# EAGLE design ARDUNI UNO - HEATER KOPI (EAGLE 9.6.1)
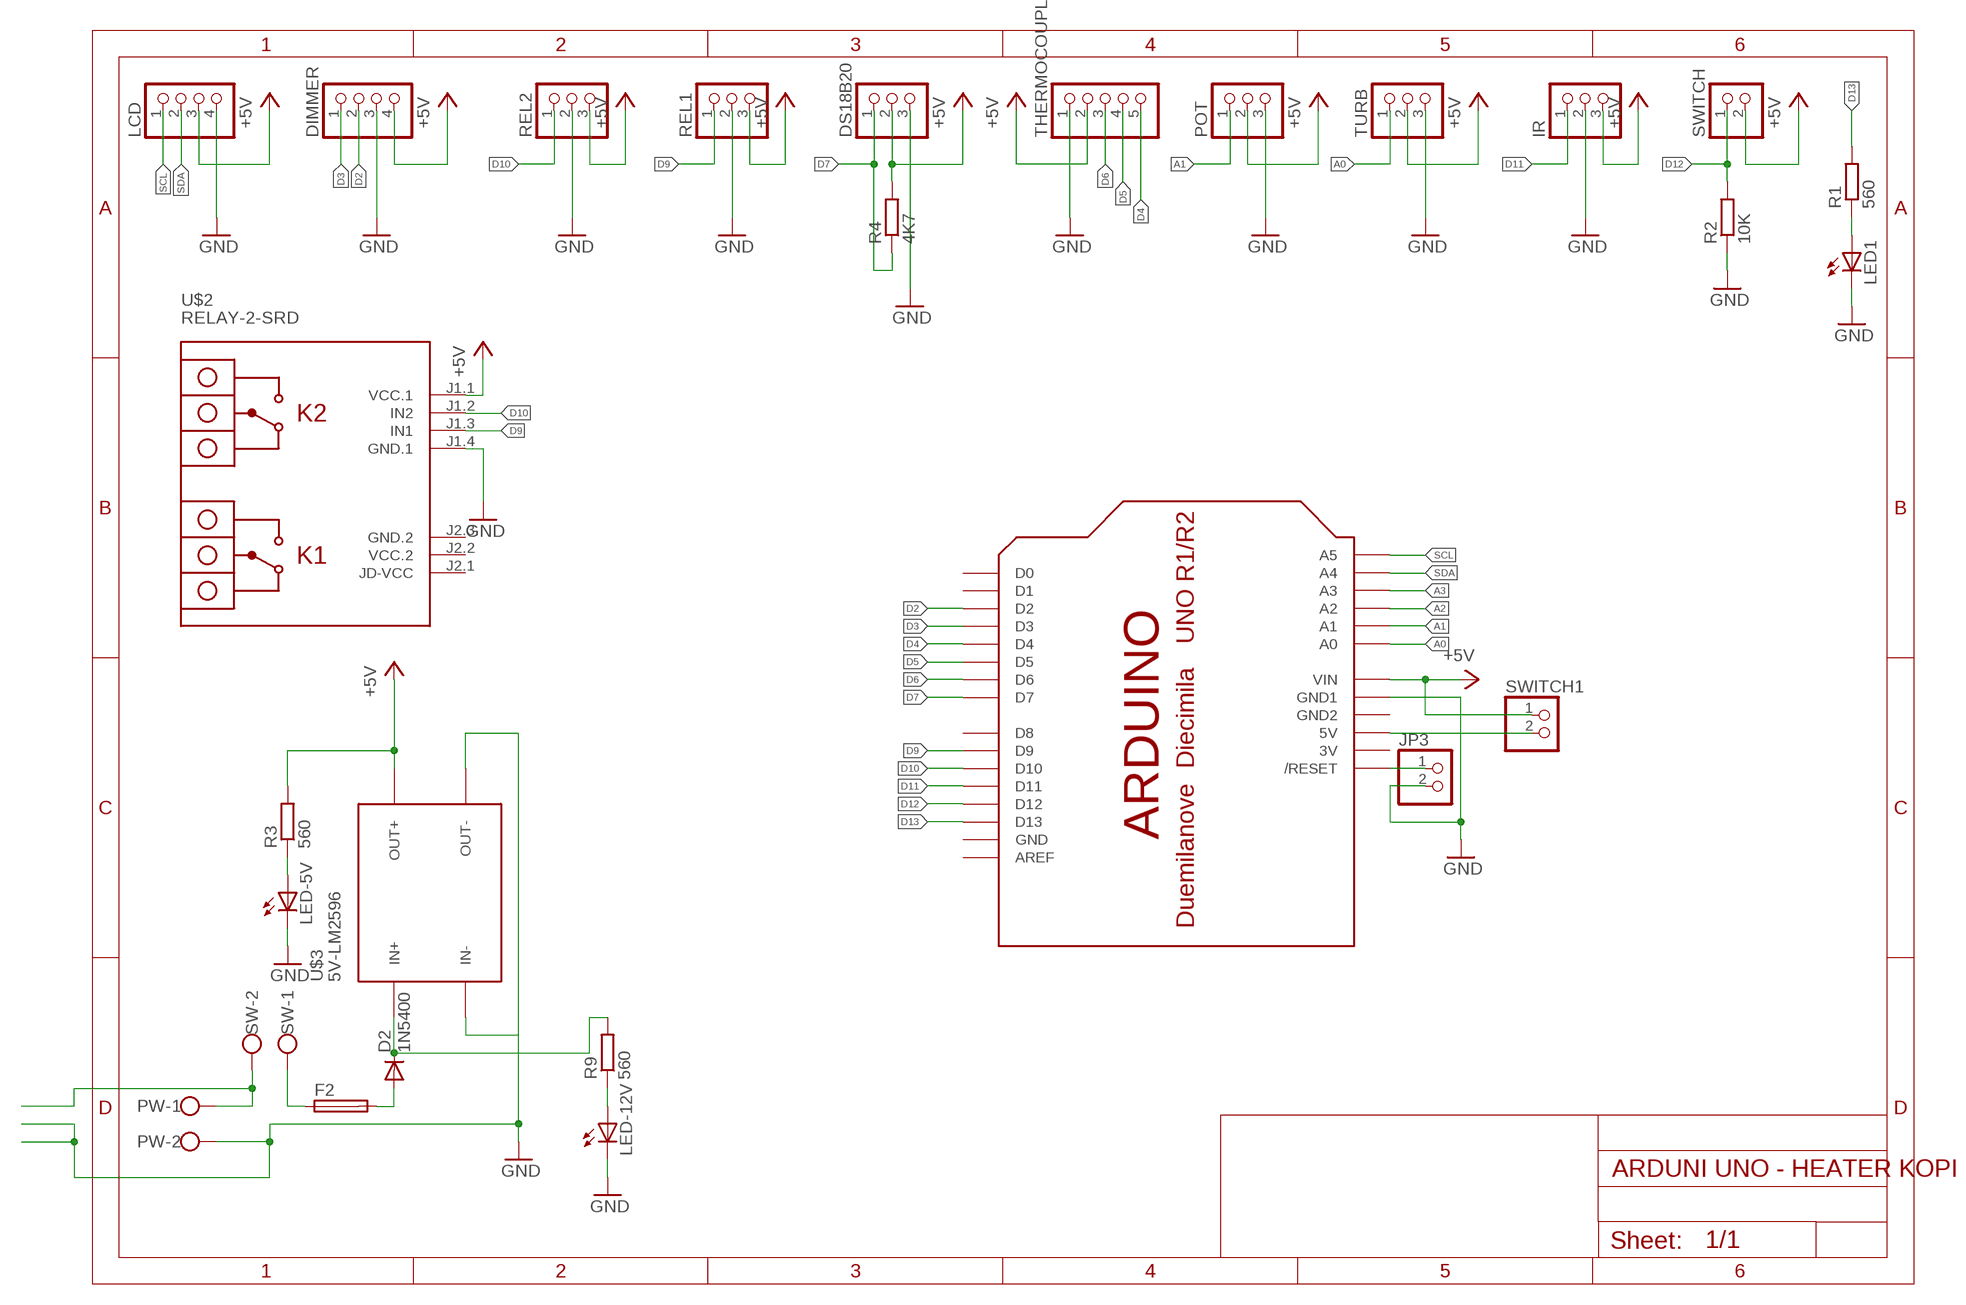
[diagram p0: schematic, sheet 1]

## Parts
D2  1N5400  [DO201-15]
DIMMER  PINHD-1X4  [1X04]
DS18B20  PINHD-1X3  [1X03]
F2  SH22,5  [SH22,5]
IR  PINHD-1X3  [1X03]
JP3  PINHD-1X2  [1X02]
LCD  PINHD-1X4  [1X04]
LED1  LED3MM  [LED3MM]
LED-5V  LED3MM  [LED3MM]
LED-12V  LED3MM  [LED3MM]
POT  PINHD-1X3  [1X03]
PW  W237-102  [W237-102]
R1  560  R-EU_0204/7  [0204/7]
R2  10K  R-EU_0204/7  [0204/7]
R3  560  R-EU_0204/7  [0204/7]
R4  4K7  R-EU_0204/7  [0204/7]
R9  560  R-EU_0204/7  [0204/7]
REL1  PINHD-1X3  [1X03]
REL2  PINHD-1X3  [1X03]
SW  W237-102  [W237-102]
SWITCH  PINHD-1X2  [1X02]
SWITCH1  PINHD-1X2  [1X02]
THERMOCOUPLE  PINHD-1X5  [1X05]
TURB  PINHD-1X3  [1X03]
U$1  ARDUINOUNO  [ARDUINO]
U$2  RELAY-2-SRD  [RELAY-2-SRD]
U$3  5V-LM2596  DC-DC-STEP-DOWN-LM2596  [DC-DC-STEP-DOWN-LM2596]

## Nets
+5V: DIMMER.4 DS18B20.2 IR.3 LCD.3 POT.2 R3.2 R4.2 REL1.3 REL2.3 SWITCH1.1 SWITCH.2 THERMOCOUPLE.2 TURB.2 U$1.VIN U$2.J1.1(VCC.1) U$3.OUT+
+12V: D2.C R9.2 U$3.IN+
A0: TURB.1 U$1.A0
A1: POT.1 U$1.A1
A2: U$1.A2
A3: U$1.A3
D2: DIMMER.2 U$1.D2
D3: DIMMER.1 U$1.D3
D4: THERMOCOUPLE.5 U$1.D4
D5: THERMOCOUPLE.4 U$1.D5
D6: THERMOCOUPLE.3 U$1.D6
D7: DS18B20.1 R4.1 U$1.D7
D9: REL1.1 U$1.D9 U$2.J1.3(IN1)
D10: REL2.1 U$1.D10 U$2.J1.2(IN2)
D11: IR.1 U$1.D11
D12: R2.2 SWITCH.1 U$1.D12
D13: R1.2 U$1.D13
GND: DIMMER.3 DS18B20.3 IR.2 JP3.2 LCD.4 LED1.K(C) LED-5V.K(C) LED-12V.K(C) POT.3 PW.2 R2.1 REL1.2 REL2.2 THERMOCOUPLE.1 TURB.3 U$1.GND1 U$2.J1.4(GND.1) U$3.IN- U$3.OUT-
N$1: F2.1 SW.1
N$2: JP3.1 U$1.RESET(/RESET)
N$3: SWITCH1.2 U$1.5V
N$4: LED1.A R1.1
N$8: LED-12V.A R9.1
N$11: D2.A F2.2
N$35: LED-5V.A R3.1
N$39: PW.1 SW.2
SCL: LCD.1 U$1.A5
SDA: LCD.2 U$1.A4
Unconnected: U$1.AREF U$1.D0 U$1.D1 U$1.D8 U$2.J2.1(JD-VCC)

## Power pins joined to a net without a drawn wire
3V: U$1.3V
GND: U$1.GND
GND2: U$1.GND2
GND.2: U$2.J2.3(GND.2)
VCC.2: U$2.J2.2(VCC.2)

## Library data of the parts
D2 = diode:1N5400: DIODE standard rectifier, 3 A, 50 V (Motorola)
DIMMER LCD = pinhead:PINHD-1X4: PIN HEADER
DS18B20 IR POT REL1 REL2 TURB = pinhead:PINHD-1X3: PIN HEADER
F2 = fuse:SH22,5: FUSE HOLDER grid 22,5 mm, OGN0031 8201, Schurter (Buerklin); MF: SCHURTER; MPN: 0031.8201; OC_FARNELL: 1162740; OC_NEWARK: 96F8317
JP3 SWITCH SWITCH1 = pinhead:PINHD-1X2: PIN HEADER
LED1 LED-5V LED-12V = led:LED: LED OSRAM: - CHIPLED LG R971, LG N971, LY N971, LG Q971, LY Q971, LO R971, LY R971 LH N974, LH R974 LS Q976, LO Q976, LY Q976 LO Q996 - Hyper CHIPLED LW Q18S LB Q993, LB Q99A, LB R99A - SideLED LS A670, LO A670, LY A670, LG A670, LP A670 LB A673, LV A673, LT A673, LW A673 LH A674 LY A675 LS A676, LA A676, LO A676, LY A676, LW A676 LS A679, LY A679, LG A679 - Hyper Micro SIDELED® LS Y876, LA Y876, LO Y876, LY Y876 LT Y87S - SmartLED LW L88C, LW L88S LB L89C, LB L89S, LG L890 LS L89K, LO L89K, LY L89K LS L896, LA L896, LO L896, LY L896 - TOPLED LS T670, LO T670, LY T670, LG T670, LP T670 LSG T670, LSP T670, LSY T670, LOP T670, LYG T670 LG T671, LOG T671, LSG T671 LB T673, LV T673, LT T673, LW T673 LH T674 LS T676, LA T676, LO T676, LY T676, LB T676, LH T676, LSB T676, LW T676 LB T67C, LV T67C, LT T67C, LS T67K, LO T67K, LY T67K, LW E67C LS E67B, LA E67B, LO E67B, LY E67B, LB E67C, LV E67C, LT E67C LW T67C LS T679, LY T679, LG T679 LS T770, LO T770, LY T770, LG T770, LP T770 LB T773, LV T773, LT T773, LW T773 LH T774 LS E675, LA E675, LY E675, LS T675 LS T776, LA T776, LO T776, LY T776, LB T776 LHGB T686 LT T68C, LB T68C - Hyper Mini TOPLED® LB M676 - Mini TOPLED Santana® LG M470 LS M47K, LO M47K, LY M47K Source: http://www.osram.convergy.de LUXEON: - LUMILED® LXK2-PW12-R00, LXK2-PW12-S00, LXK2-PW14-U00, LXK2-PW14-V00 LXK2-PM12-R00, LXK2-PM12-S00, LXK2-PM14-U00 LXK2-PE12-Q00, LXK2-PE12-R00, LXK2-PE12-S00, LXK2-PE14-T00, LXK2-PE14-U00 LXK2-PB12-K00, LXK2-PB12-L00, LXK2-PB12-M00, LXK2-PB14-N00, LXK2-PB14-P00, LXK2-PB14-Q00 LXK2-PR12-L00, LXK2-PR12-M00, LXK2-PR14-Q00, LXK2-PR14-R00 LXK2-PD12-Q00, LXK2-PD12-R00, LXK2-PD12-S00 LXK2-PH12-R00, LXK2-PH12-S00 LXK2-PL12-P00, LXK2-PL12-Q00, LXK2-PL12-R00 Source: www.luxeon.com KINGBRIGHT: KA-3528ASYC Source: www.kingbright.com
PW SW = con-wago-500:W237-102: WAGO SCREW CLAMP; MPN: 237-102; OC_FARNELL: unknown; OC_NEWARK: 70K9898
R1-R4 R9 = rcl:R-EU_: RESISTOR, European symbol; SPICEPREFIX: R
THERMOCOUPLE = pinhead:PINHD-1X5: PIN HEADER
U$1 = adafruit:ARDUINO: Arduino Diecimila/Duemilanove Make a shield with ease, this package has all the named pins as well as the two mounting drill holes and an outline of the USB and DC power connector. The outline is on the DIMENSION layer, so if your board house uses it they will cut the outline to match. http://www.ladyada.net/library/pcb/eaglelibrary.html
U$2 = diy-modules:RELAY-2-SRD: 2-Channel Relay Module based on SRD-05VDC-SL-C relays Click here to find device on ebay.com <http://www.ebay.com/sch/two+channel+relay+module+optocoupler+5v>
U$3 = diy-modules:DC-DC-STEP-DOWN-LM2596: DC/DC Step-Down Regulator based on LM2596-ADJ chip LM2596 datasheet available here: http://www.ti.com/lit/ds/symlink/lm2596.pdf Click here to find device on ebay.com <http://www.ebay.com/sch/lm2596+power+regulator>

## Board
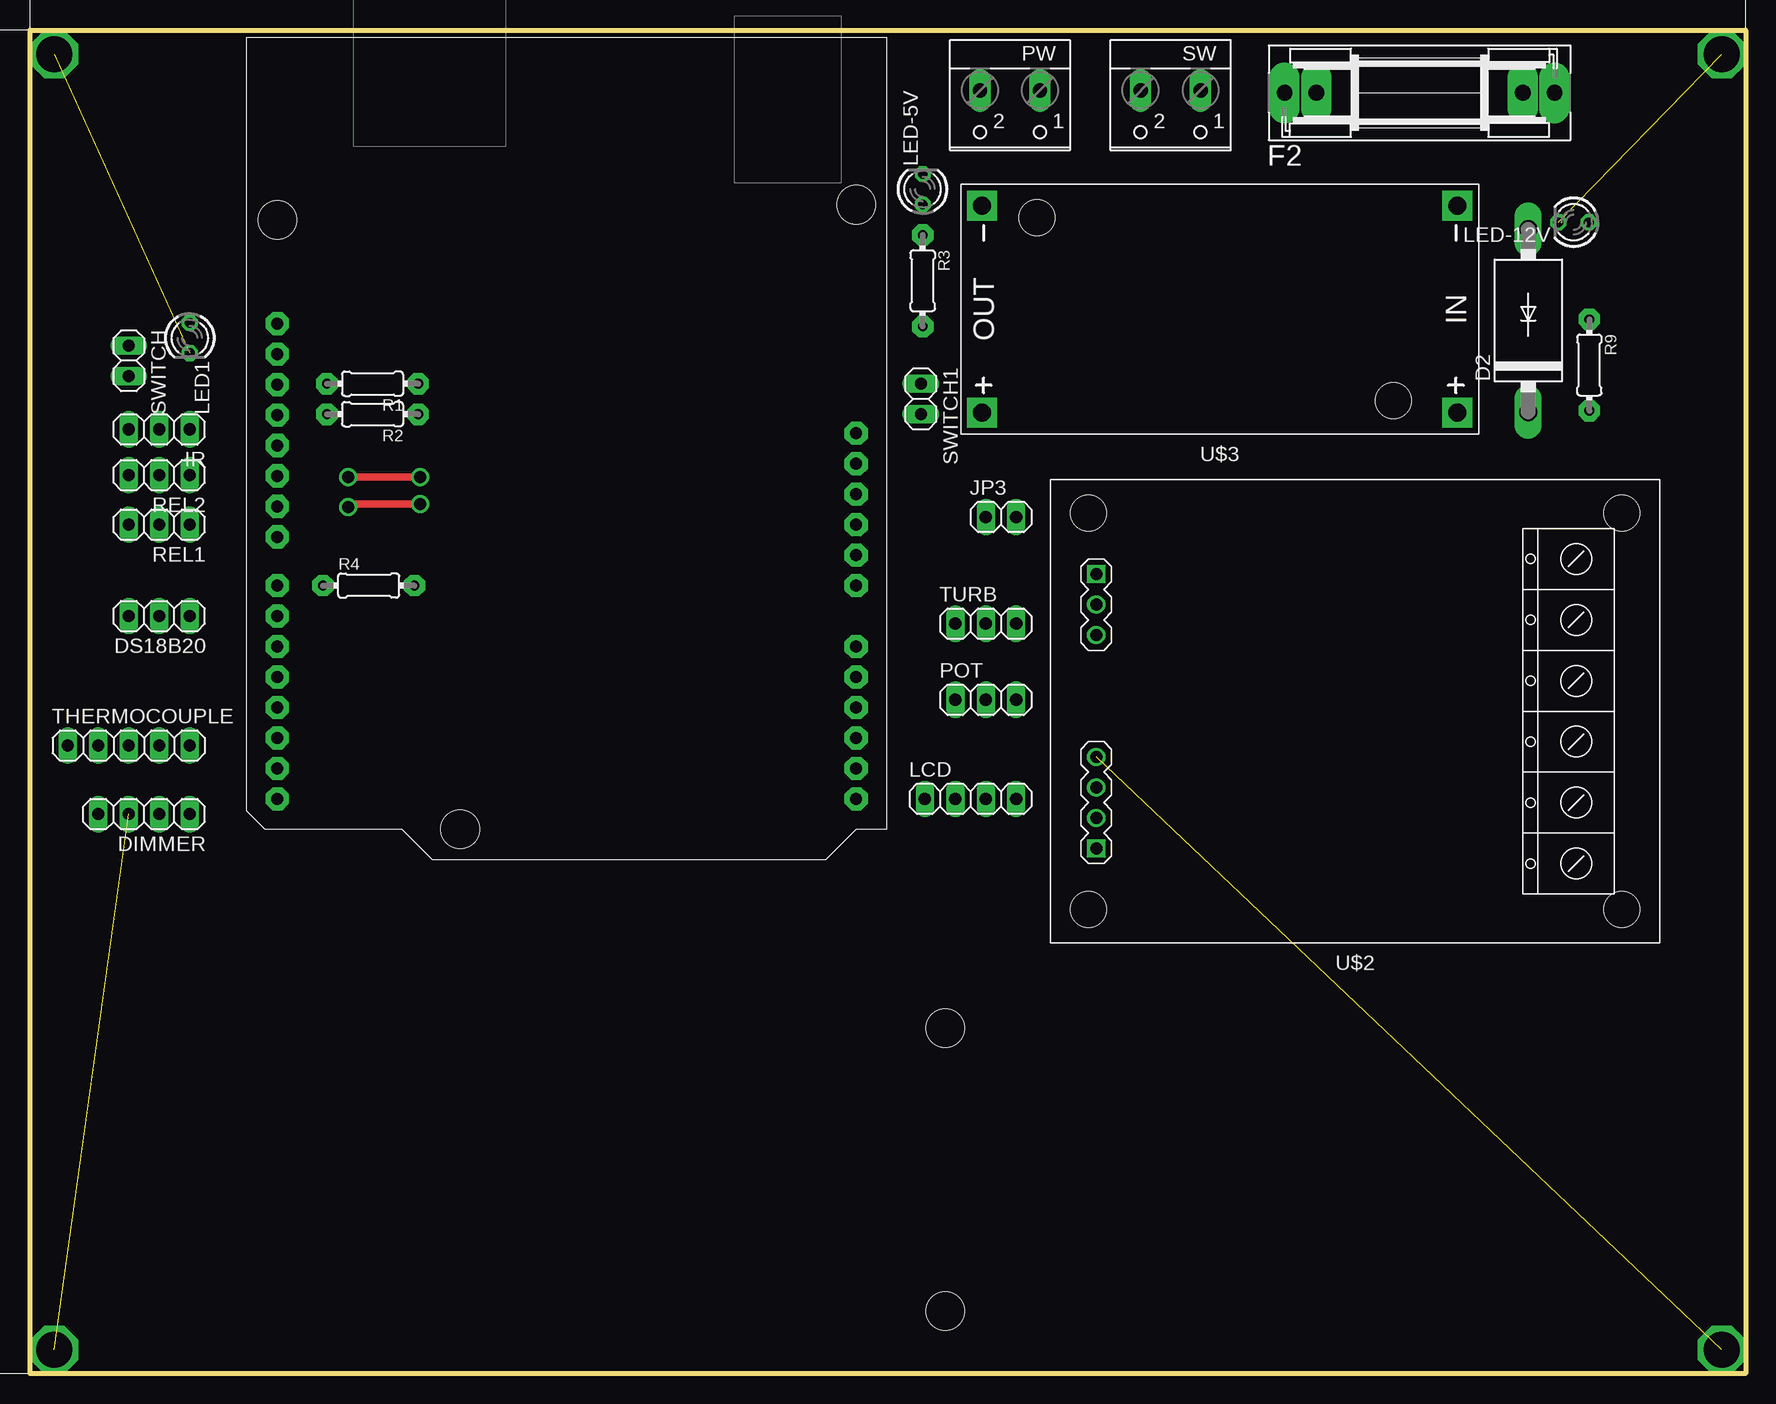
[diagram p1: board, top side]
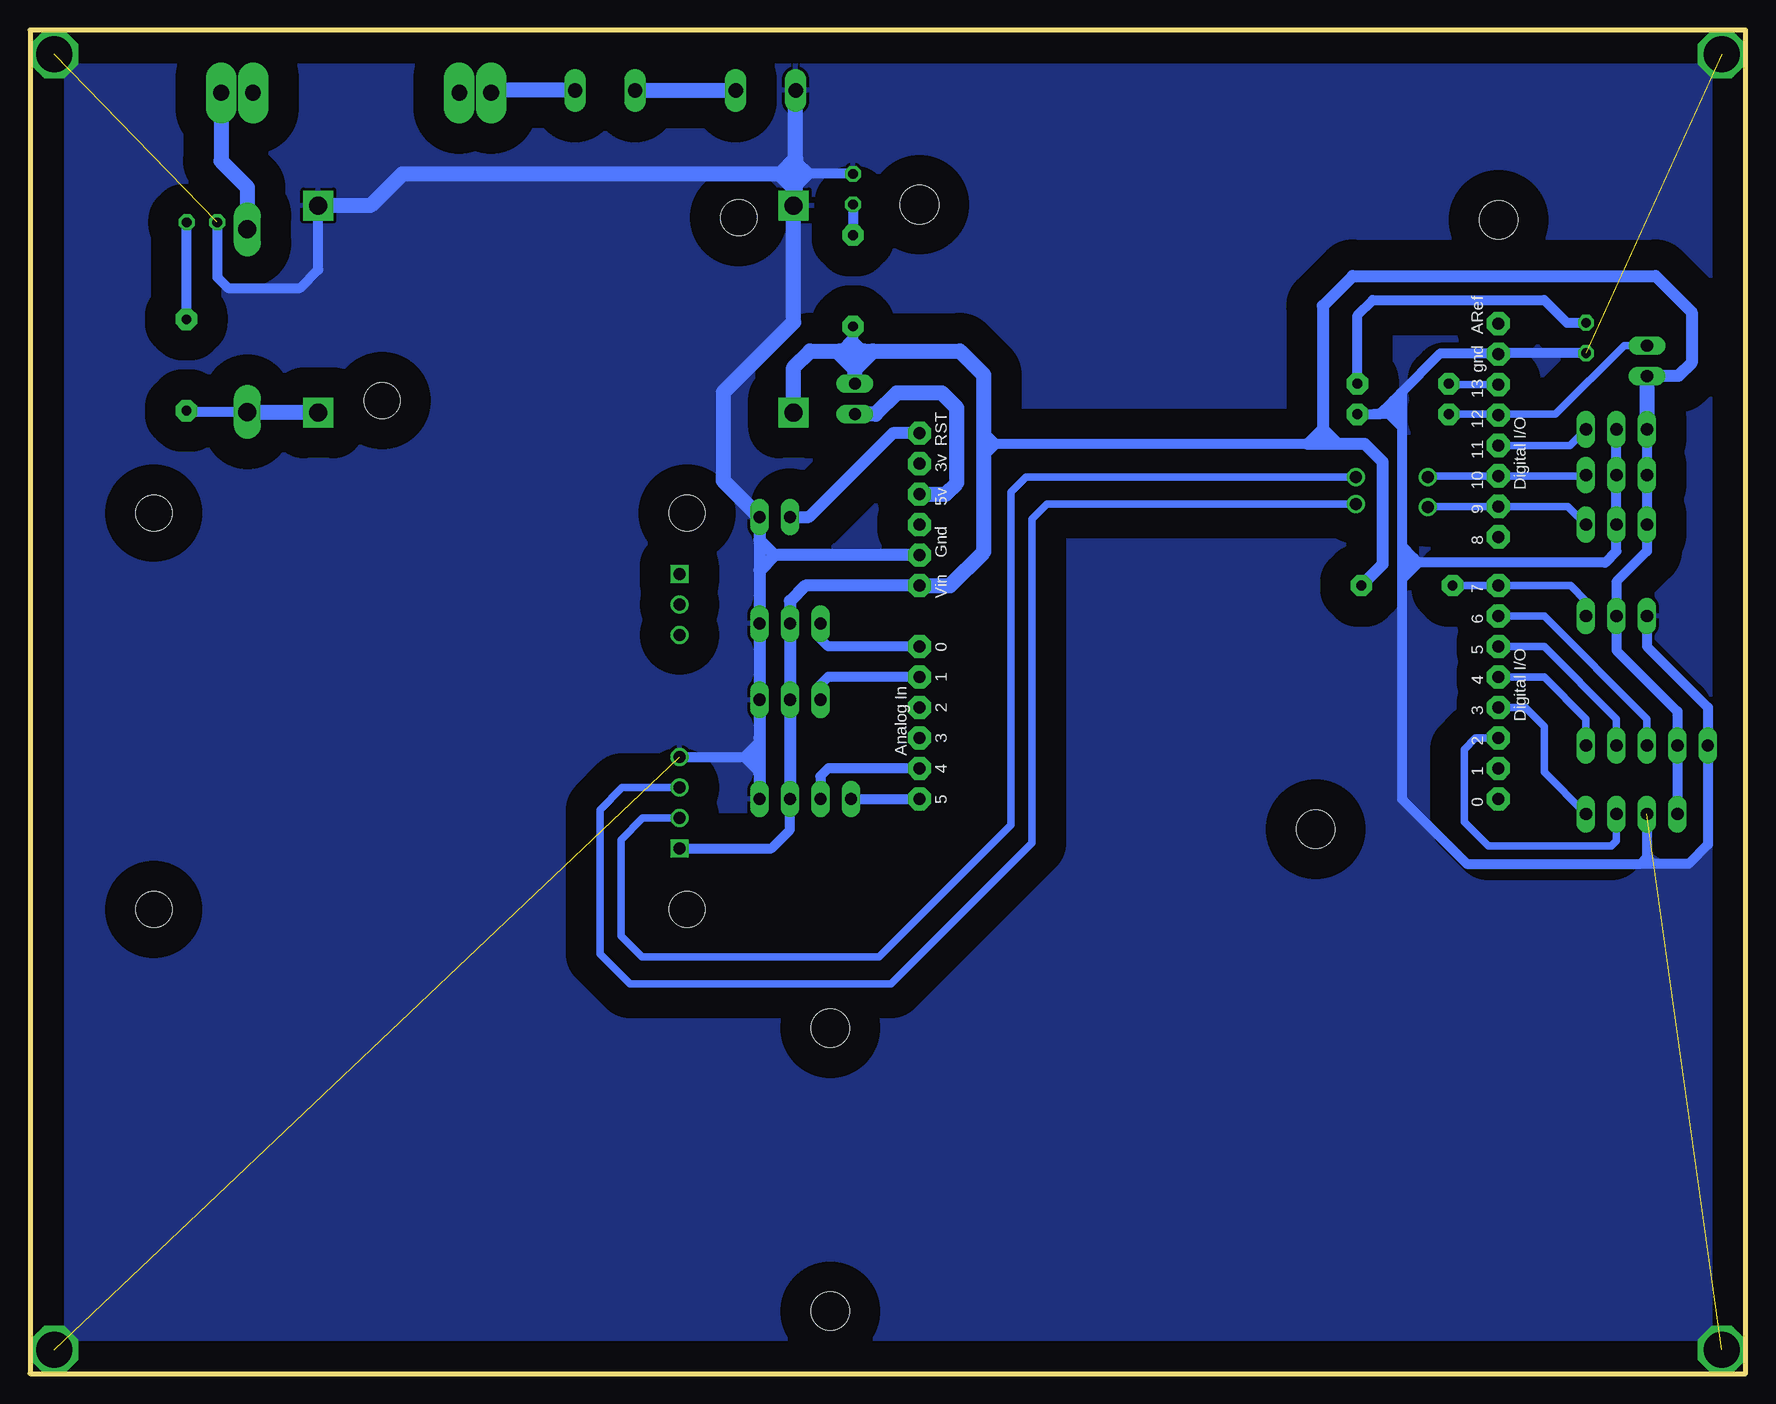
[diagram p2: board, bottom side, seen from below]

Size 143 x 112 mm. Coordinates in mm from the lower left corner, seen from the top.
Outline: 0,112 143,112 143,0 0,0 0,112
Copper layers (1*16): Top 0.035mm / dielectric 1.5mm / Bottom 0.035mm
Design rules "default": minimum track width 6mil, minimum drill 0.35mm, track to track 6mil, track to pad 6mil, pad to pad 6mil, via to via 6mil, smd to smd 6mil, copper to edge 40mil, drill to drill 6mil, minimum pad ring 10mil, minimum via ring 8mil, stop-mask expansion 4mil, vias tented up to drill 0mil, thermal gap 10mil
Holes 3.2 mm at 76.3,28.8 76.3,5.2

### Footprints (pad centres in the part's own frame; a part is rotated, then mirrored left to right if it is on the bottom)
DO201-15 = drill 1.499 long: A 7.62,0; C -7.62,0
1X04 = drill 1.016 long: 1 -3.81,0; 2 -1.27,0; 3 1.27,0; 4 3.81,0
1X03 = drill 1.016 long: 1 -2.54,0; 2 0,0; 3 2.54,0
SH22,5 = drill 1.321 pad 2.54 long: 1 -11.252,0; 2 11.252,0; P$1 -8.6,0; P$2 8.6,0
1X02 = drill 1.016 long: 1 -1.27,0; 2 1.27,0
LED3MM = drill 0.813 octagon: A -1.27,0; K 1.27,0
W237-102 = drill 1.194 long: 1 -2.5,-1.27; 2 2.5,-1.27
0204/7 = drill 0.813 pad 1.778 octagon: 1 -3.81,0; 2 3.81,0
1X05 = drill 1.016 long: 1 -5.08,0; 2 -2.54,0; 3 0,0; 4 2.54,0; 5 5.08,0
ARDUINO = drill 1 pad 1.93 octagon: 3V 35.56,2.54; 5V 38.1,2.54; A0 50.8,2.54; A1 53.34,2.54; A2 55.88,2.54; A3 58.42,2.54; A4 60.96,2.54; A5 63.5,2.54; AREF 23.876,50.8; D0 63.5,50.8; D1 60.96,50.8; D2 58.42,50.8; D3 55.88,50.8; D4 53.34,50.8; D5 50.8,50.8; D6 48.26,50.8; D7 45.72,50.8; D8 41.656,50.8; D9 39.116,50.8; D10 36.576,50.8; D11 34.036,50.8; D12 31.496,50.8; D13 28.956,50.8; GND 26.416,50.8; GND1 43.18,2.54; GND2 40.64,2.54; RESET 33.02,2.54; VIN 45.72,2.54 | hole 3.2: 15.24,50.8; 66.04,35.56; 13.97,2.54
RELAY-2-SRD = drill 1 square: J1.1 21.59,11.43; J2.1 21.59,-11.43 | drill 1: J1.2 21.59,8.89; J1.3 21.59,6.35; J1.4 21.59,3.81; J2.2 21.59,-8.89; J2.3 21.59,-6.35 | hole 3: -22.225,16.51; 22.225,16.51; 22.225,-16.51; -22.225,-16.51
DC-DC-STEP-DOWN-LM2596 = drill 1.5 pad 2.5 square: IN+ -19.812,8.636; IN- -19.812,-8.636; OUT+ 19.812,8.636; OUT- 19.812,-8.636 | hole 3: -14.478,7.62; 15.24,-7.62

### Placement (x,y rotation side)
D2  124.89,87.78 90 top
DIMMER  9.49,46.64 180 top
DS18B20  10.76,63.15 180 top
F2  115.82,106.77 0 top
IR  10.76,78.71 180 top
JP3  80.93,71.41 0 top
LCD  78.39,47.91 0 top
LED1  13.3,86.33 270 top
LED-5V  74.4,98.74 90 top
LED-12V  128.66,95.97 180 top
POT  79.66,56.17 0 top
PW  81.69,105.71 180 top
R1  28.54,82.52 180 top
R2  28.54,79.98 180 top
R3  74.4,91.1 270 top
R4  28.23,65.69 0 top
R9  129.97,84.08 270 top
REL1  10.76,70.77 180 top
REL2  10.76,74.9 180 top
SW  95.07,105.71 180 top
SWITCH  8.22,84.42 270 top
SWITCH1  74.25,81.25 270 top
THERMOCOUPLE  8.22,52.36 0 top
TURB  79.66,62.52 0 top
U$1  71.41,111.41 270 bottom
U$2  110.46,55.22 180 top
U$3  99.17,88.73 180 top

### Tracks (layer width: path | path; a pad name or v marks a point on that pad's centre or on a via)
+5V
  Bottom 0.813: IR.3 REL2.3 REL1.3 | REL1.3 8.22,69.82 | DIMMER.4 THERMOCOUPLE.2 5.68,55.22 10.76,60.3 DS18B20.2 10.76,66.01 8.22,68.55 REL1.3 | U$2.J1.1 81.22,43.78 79.66,45.34 LCD.3 | 74.4,86 R3.2 74.4,86.35 75.5,85.25 75.15,85.25 74.4,86 | 74.4,86 74.4,85.35 74.5,85.25 | 74.4,86 74.25,86 73.5,85.25 | 36.5,77.5 62.5,77.5 | 62.5,77.5 63.5,78.5 | 62.5,77.5 63.5,76.5
  Bottom 1.016: LCD.3 POT.2 TURB.2 79.66,64.42 78.39,65.69 U$1.VIN | R4.2 30.25,67.48 30.25,76 31.75,77.5 34,77.5 | 34,77.5 35.25,77.5 | 35.25,77.5 36.5,77.5 35.25,78.75 | 35.25,77.5 35.25,78.75 | 35.25,78.75 35.25,89 32.75,91.5 7.5,91.5 4.5,88.5 4.5,84.25 5.59,83.16 SWITCH.2 | 35.25,78.75 34,77.5
  Bottom 1.27: U$1.VIN 66.31,65.69 63.5,68.5 63.5,76.5 63.5,78.5 63.5,83.25 65.5,85.25 72.75,85.25 | SWITCH.2 IR.3 | U$3.OUT+ 79.36,83.89 78,85.25 75.5,85.25 | 75.5,85.25 74.5,85.25 | 74.5,85.25 73.5,85.25 72.75,85.25 | SWITCH1.1 74.25,83.75 | 74.25,83.75 74.25,85 74.5,85.25 | 74.25,83.75 75.5,85 75.5,85.25 | 74.25,83.75 72.75,85.25
+12V
  Bottom 0.813: D2.C 129.87,80.16 R9.2
  Bottom 1.27: U$3.IN+ 124.82,80.1 D2.C
A0
  Bottom 0.813: U$1.A0 76.48,60.61 77.12,61.25 TURB.1
A1
  Bottom 0.813: U$1.A1 76.48,58.07 77.12,57.44 POT.1
D2
  Bottom 0.61: U$1.D2 22.51,52.99 23.46,52.04 23.46,46.01 21.44,43.98 11.2,43.98 10.76,44.42 DIMMER.2
D3
  Bottom 0.61: U$1.D3 18.38,55.53 16.8,53.95 16.8,50.13 DIMMER.1
D4
  Bottom 0.61: THERMOCOUPLE.5 13.3,54.58 16.8,58.07 U$1.D4
D5
  Bottom 0.61: THERMOCOUPLE.4 10.76,54.58 16.8,60.61 U$1.D5
D6
  Bottom 0.61: THERMOCOUPLE.3 8.22,54.58 16.8,63.15 U$1.D6
D7
  Bottom 0.61: DS18B20.1 13.3,64.42 14.57,65.69 20.5,65.69 | U$1.D7 R4.1
  Bottom 0.813: 20.5,65.69 U$1.D7
D9  (via drill 1)
  Top 0.61: v26.5,72.25 26.75,72.5 v32.5,72.5
  Bottom 0.61: REL1.1 14.83,72.3 U$1.D9 26.45,72.3 v26.5,72.25 | U$2.J1.3 93.64,48.87 95.5,47 95.5,35 93,32.5 71.25,32.5 59.5,44.25 59.5,71.25 58.25,72.5 v32.5,72.5
D10  (via drill 1)
  Top 0.61: v26.5,74.75 v32.5,74.75
  Bottom 0.61: REL2.1 13.37,74.84 U$1.D10 26.41,74.84 v26.5,74.75 | U$2.J1.2 91.92,46.33 93.75,44.5 93.75,36.5 92,34.75 72.25,34.75 61.25,45.75 61.25,73.5 60,74.75 v32.5,74.75
D11
  Bottom 0.61: U$1.D11 14.64,77.38 IR.1
D12
  Bottom 0.61: SWITCH.1 10.13,85.69 15.84,79.98 20,79.98 | U$1.D12 20.67,79.98 R2.2
  Bottom 0.813: U$1.D12 20.54,79.98 20,79.98
D13
  Bottom 0.61: U$1.D13 24.67,82.46
  Bottom 0.813: 24.67,82.46 R1.2
GND  (via drill 3)  (4 unrouted)
  Bottom 0.813: LED1.K 20.54,85.06 | 20.54,85.06 U$1.GND | R2.1 31,79.98 | 31,79.98 30.52,79.98 30.11,80.38 | 20.54,85.06 25.43,85.06 28.75,81.75 | 30.11,80.38 29.37,81.12 | 29.37,81.12 28.75,81.75 | IR.2 REL2.2 REL1.2 10.76,68.55 11.71,67.6 27.25,67.6 | DIMMER.3 8.22,43.03 | DS18B20.3 8.22,60.61 3.14,55.53 THERMOCOUPLE.1 3.14,44.1 4.75,42.5 7.7,42.5 | LED-5V.K 78,100.01 | 78,100.01 80.49,100.01 80.5,100 | 78,100.01 79.19,101.2 79.19,101.31 | 78,100.01 79.01,99 79.19,99 | LED-12V.K 127.39,91.39 126.5,90.5 120.5,90.5 118.98,92.02 U$3.IN- | U$2.J1.4 83.5,51.41 | 83.5,51.41 82.3,51.41 82.2,51.5 | 83.5,51.41 82.2,52.7 82.2,53 | 83.5,51.41 82.2,50.1 82.2,50 | 28.63,66.22 28.63,47.88 23.25,42.5 8.75,42.5 | 8.75,42.5 8.22,43.03 | 28.63,66.22 27.25,67.6 | 28.63,66.22 28.63,67.25 | 28.63,67.25 28.63,68 | 28.63,68 28.63,68.98 | 28.63,68.98 28.63,78.88 | 28.63,78.88 28.63,80 | 28.63,80 28.63,80.38 | 28.63,80.38 29.37,81.12 | 28.63,80.38 30.11,80.38 | 28.63,80 29.75,80 | 29.75,80 30.98,80 31,79.98 | 28.63,80.38 28.63,81.63 28.75,81.75 | 28.63,78.88 29.75,80 | 27.65,68 28.63,68.98 | 27.25,67.6 27.65,68 | 27.65,68 28.63,68 | 27.25,67.6 28.28,67.6 28.63,67.25 | 7.7,42.5 8.75,42.5 | 8.22,43.03 7.7,42.5
  Bottom 1.016: LCD.4 82.2,50 82.2,51.5 82.2,53 POT.3 TURB.3 82.2,66.96 | JP3.2 82.2,69.5 | 82.2,69.5 82.2,66.96 | 82.2,69.5 80.93,68.23 | U$1.GND1 80.93,68.23 | 80.93,68.23 82.2,66.96
  Bottom 1.27: U$3.OUT- 79.19,97.54 79.19,99 79.19,100 | 79.19,100 79.19,101.31 | 79.19,101.31 PW.2 | 79.19,100 80.5,100 | 80.5,100 112,100 114.63,97.37 U$3.IN- | JP3.2 85.2,74.41 85.2,81.8 79.36,87.64 U$3.OUT- | U$3.OUT- 79.36,98.86 80.5,100 | 79.19,101.31 80.5,100
  other vias: 141,110 141,2 2,2 2,110
  pour Bottom (isolate 2.54): 1,1 142,1 142,111 1,111 1,107
N$1
  Bottom 1.27: SW.1 104.36,106.98 F2.1
N$2
  Bottom 1.016: JP3.1 78.07,71.41 71.09,78.39 U$1.RESET
N$3
  Bottom 1.27: U$1.5V 66.69,73.31 65.75,74.25 65.75,80.5 67,81.75 70.75,81.75 72.52,79.98 SWITCH1.2
N$4
  Bottom 0.813: R1.1 32.35,88.23 31.08,89.5 16.8,89.5 14.89,87.6 LED1.A
N$8
  Bottom 0.813: LED-12V.A 129.97,95.94 R9.1
N$11
  Bottom 1.27: F2.2 127.08,101.08 124.89,98.89 D2.A
N$35
  Bottom 0.813: LED-5V.A R3.1
N$39
  Bottom 1.27: SW.2 PW.1
SCL
  Bottom 0.813: LCD.1 U$1.A5
SDA
  Bottom 0.813: U$1.A4 76.48,50.45 77.12,49.82 LCD.2